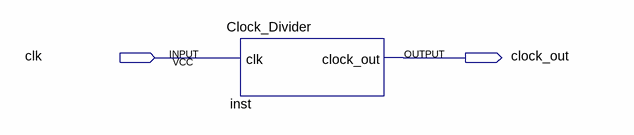
[diagram p0: schematic sheet]
// Quartus schematic testclockdivider.bdf as structural Verilog: 1 symbols, 2 pins
module testclockdivider (
  input  clk,
  output clock_out
);

  Clock_Divider inst (.clk(clk), .clock_out(clock_out));
endmodule
